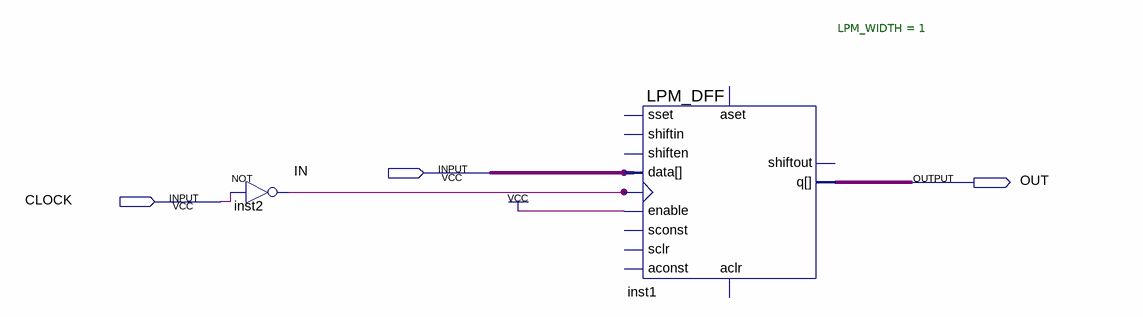
[diagram p0: schematic sheet]
// Quartus schematic PIPE1_Negedge.bdf as structural Verilog: 2 symbols, 3 pins
module PIPE1_Negedge (
  input  IN,
  input  CLOCK,
  output OUT
);

  wire inst2_out;

  not inst2 (inst2_out, CLOCK);
  LPM_DFF #(.LPM_WIDTH(1)) inst1 (
    .enable(1'b1), .clock(inst2_out), .data(IN), .q(OUT));  // open: shiftin, shiften, aconst, sclr, sconst, sset, aset, aclr, shiftout
endmodule
